# EAGLE design RAM (EAGLE 9.6.2)
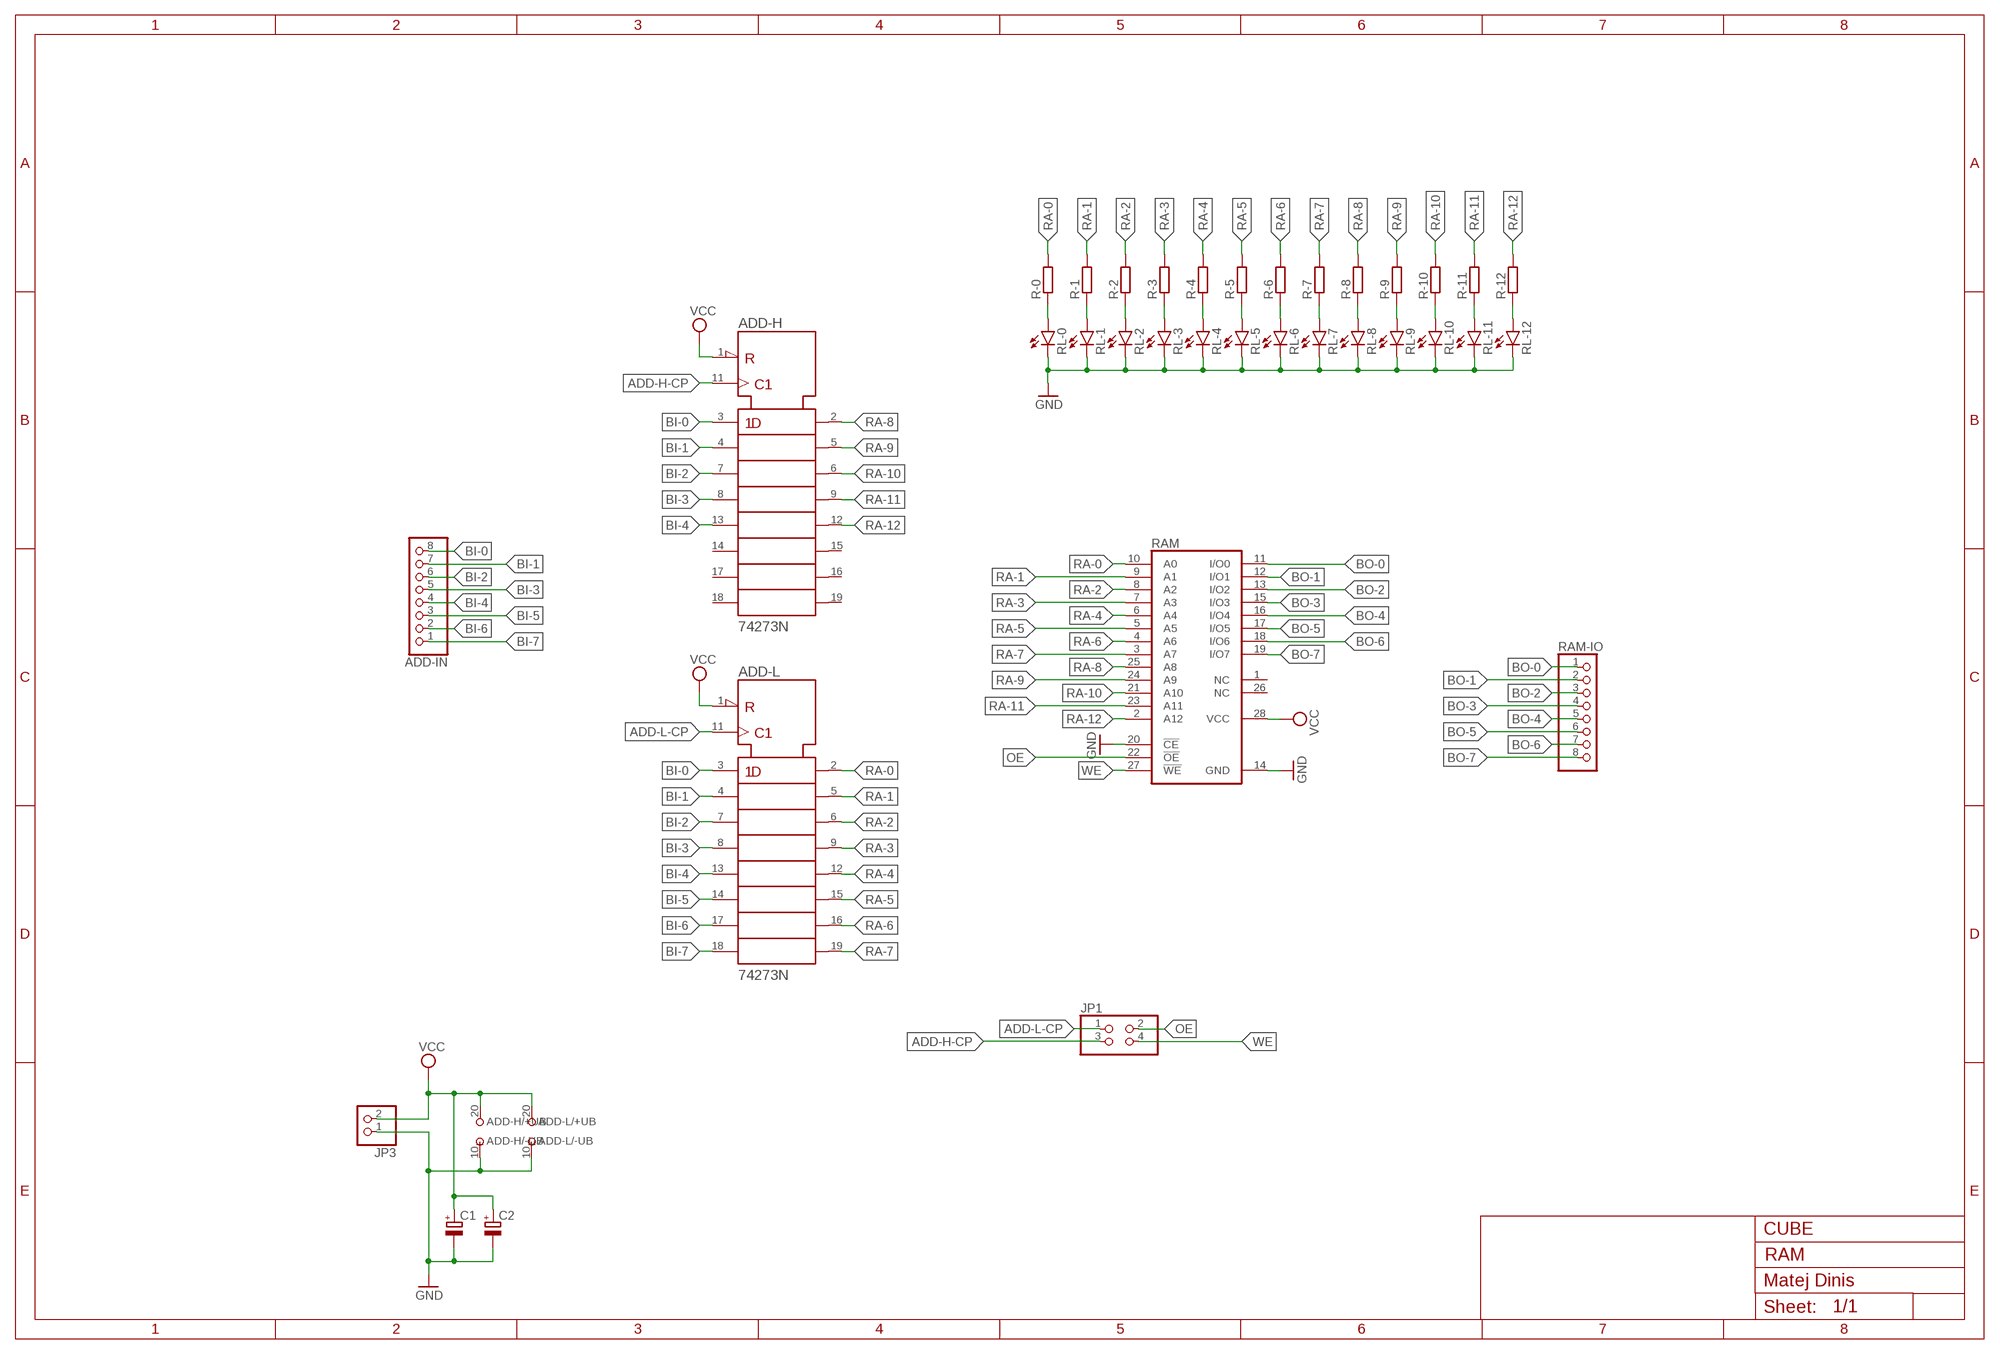
[diagram p0: schematic, sheet 1]

## Parts
ADD-H  74273N  [DIL20]
ADD-IN  PINHD-1X8  [1X08]
ADD-L  74273N  [DIL20]
C1  CPOL-EUE3.5-8  [E3,5-8]
C2  CPOL-EUE3.5-8  [E3,5-8]
JP1  PINHD-2X2  [2X02]
JP3  PINHD-1X2  [1X02]
R-0  R-EU_0207/10  [0207/10]
R-1  R-EU_0207/10  [0207/10]
R-2  R-EU_0207/10  [0207/10]
R-3  R-EU_0207/10  [0207/10]
R-4  R-EU_0207/10  [0207/10]
R-5  R-EU_0207/10  [0207/10]
R-6  R-EU_0207/10  [0207/10]
R-7  R-EU_0207/10  [0207/10]
R-8  R-EU_0207/10  [0207/10]
R-9  R-EU_0207/10  [0207/10]
R-10  R-EU_0207/10  [0207/10]
R-11  R-EU_0207/10  [0207/10]
R-12  R-EU_0207/10  [0207/10]
RAM  28C64C  [DIL28-6]
RAM-IO  PINHD-1X8  [1X08]
RL-0  LED5MM  [LED5MM]
RL-1  LED5MM  [LED5MM]
RL-2  LED5MM  [LED5MM]
RL-3  LED5MM  [LED5MM]
RL-4  LED5MM  [LED5MM]
RL-5  LED5MM  [LED5MM]
RL-6  LED5MM  [LED5MM]
RL-7  LED5MM  [LED5MM]
RL-8  LED5MM  [LED5MM]
RL-9  LED5MM  [LED5MM]
RL-10  LED5MM  [LED5MM]
RL-11  LED5MM  [LED5MM]
RL-12  LED5MM  [LED5MM]

## Nets
ADD-H-CP: ADD-H.11(CLK) JP1.3
ADD-L-CP: ADD-L.11(CLK) JP1.1
BI-0: ADD-H.3(1D) ADD-IN.8 ADD-L.3(1D)
BI-1: ADD-H.4(2D) ADD-IN.7 ADD-L.4(2D)
BI-2: ADD-H.7(3D) ADD-IN.6 ADD-L.7(3D)
BI-3: ADD-H.8(4D) ADD-IN.5 ADD-L.8(4D)
BI-4: ADD-H.13(5D) ADD-IN.4 ADD-L.13(5D)
BI-5: ADD-IN.3 ADD-L.14(6D)
BI-6: ADD-IN.2 ADD-L.17(7D)
BI-7: ADD-IN.1 ADD-L.18(8D)
BO-0: RAM-IO.1 RAM.11(I/O0)
BO-1: RAM-IO.2 RAM.12(I/O1)
BO-2: RAM-IO.3 RAM.13(I/O2)
BO-3: RAM-IO.4 RAM.15(I/O3)
BO-4: RAM-IO.5 RAM.16(I/O4)
BO-5: RAM-IO.6 RAM.17(I/O5)
BO-6: RAM-IO.7 RAM.18(I/O6)
BO-7: RAM-IO.8 RAM.19(I/O7)
GND: ADD-H.10(-UB) ADD-L.10(-UB) C1.- C2.- JP3.1 RAM.14(GND) RAM.20(!CE) RL-0.K(C) RL-1.K(C) RL-2.K(C) RL-3.K(C) RL-4.K(C) RL-5.K(C) RL-6.K(C) RL-7.K(C) RL-8.K(C) RL-9.K(C) RL-10.K(C) RL-11.K(C) RL-12.K(C)
N$1: R-0.1 RL-0.A
N$4: R-1.1 RL-1.A
N$7: R-2.1 RL-2.A
N$10: R-3.1 RL-3.A
N$13: R-4.1 RL-4.A
N$16: R-5.1 RL-5.A
N$19: R-6.1 RL-6.A
N$22: R-7.1 RL-7.A
N$25: R-8.1 RL-8.A
N$28: R-9.1 RL-9.A
N$31: R-10.1 RL-10.A
N$34: R-11.1 RL-11.A
N$37: R-12.1 RL-12.A
OE: JP1.2 RAM.22(!OE)
RA-0: ADD-L.2(1Q) R-0.2 RAM.10(A0)
RA-1: ADD-L.5(2Q) R-1.2 RAM.9(A1)
RA-2: ADD-L.6(3Q) R-2.2 RAM.8(A2)
RA-3: ADD-L.9(4Q) R-3.2 RAM.7(A3)
RA-4: ADD-L.12(5Q) R-4.2 RAM.6(A4)
RA-5: ADD-L.15(6Q) R-5.2 RAM.5(A5)
RA-6: ADD-L.16(7Q) R-6.2 RAM.4(A6)
RA-7: ADD-L.19(8Q) R-7.2 RAM.3(A7)
RA-8: ADD-H.2(1Q) R-8.2 RAM.25(A8)
RA-9: ADD-H.5(2Q) R-9.2 RAM.24(A9)
RA-10: ADD-H.6(3Q) R-10.2 RAM.21(A10)
RA-11: ADD-H.9(4Q) R-11.2 RAM.23(A11)
RA-12: ADD-H.12(5Q) R-12.2 RAM.2(A12)
VCC: ADD-H.1(!CLR) ADD-H.20(+UB) ADD-L.1(!CLR) ADD-L.20(+UB) C1.+ C2.+ JP3.2 RAM.28(VCC)
WE: JP1.4 RAM.27(!WE)
Unconnected: ADD-H.14(6D) ADD-H.15(6Q) ADD-H.16(7Q) ADD-H.17(7D) ADD-H.18(8D) ADD-H.19(8Q) RAM.1(NC) RAM.26(NC)

## Notes on the sheet
- CUBE
- Matej Dinis

## Library data of the parts
ADD-H ADD-L = 74ttl-din:74*273: Octal D type FLIP FLOP, clear
ADD-IN RAM-IO = pinhead:PINHD-1X8: PIN HEADER
C1 C2 = rcl:CPOL-EU: POLARIZED CAPACITOR, European symbol; SPICEPREFIX: C
JP1 = pinhead:PINHD-2X2: PIN HEADER
JP3 = pinhead:PINHD-1X2: PIN HEADER
R-0 R-1-R-12 = rcl:R-EU_: RESISTOR, European symbol; SPICEPREFIX: R
RAM = memory-nec:28C64C: MEMORY; MPN: AT28C64B-15PU; OC_FARNELL: 1095784; OC_NEWARK: 96K6557
RL-0 RL-1-RL-12 = led:LED: LED OSRAM: - CHIPLED LG R971, LG N971, LY N971, LG Q971, LY Q971, LO R971, LY R971 LH N974, LH R974 LS Q976, LO Q976, LY Q976 LO Q996 - Hyper CHIPLED LW Q18S LB Q993, LB Q99A, LB R99A - SideLED LS A670, LO A670, LY A670, LG A670, LP A670 LB A673, LV A673, LT A673, LW A673 LH A674 LY A675 LS A676, LA A676, LO A676, LY A676, LW A676 LS A679, LY A679, LG A679 - Hyper Micro SIDELED® LS Y876, LA Y876, LO Y876, LY Y876 LT Y87S - SmartLED LW L88C, LW L88S LB L89C, LB L89S, LG L890 LS L89K, LO L89K, LY L89K LS L896, LA L896, LO L896, LY L896 - TOPLED LS T670, LO T670, LY T670, LG T670, LP T670 LSG T670, LSP T670, LSY T670, LOP T670, LYG T670 LG T671, LOG T671, LSG T671 LB T673, LV T673, LT T673, LW T673 LH T674 LS T676, LA T676, LO T676, LY T676, LB T676, LH T676, LSB T676, LW T676 LB T67C, LV T67C, LT T67C, LS T67K, LO T67K, LY T67K, LW E67C LS E67B, LA E67B, LO E67B, LY E67B, LB E67C, LV E67C, LT E67C LW T67C LS T679, LY T679, LG T679 LS T770, LO T770, LY T770, LG T770, LP T770 LB T773, LV T773, LT T773, LW T773 LH T774 LS E675, LA E675, LY E675, LS T675 LS T776, LA T776, LO T776, LY T776, LB T776 LHGB T686 LT T68C, LB T68C - Hyper Mini TOPLED® LB M676 - Mini TOPLED Santana® LG M470 LS M47K, LO M47K, LY M47K Source: http://www.osram.convergy.de LUXEON: - LUMILED® LXK2-PW12-R00, LXK2-PW12-S00, LXK2-PW14-U00, LXK2-PW14-V00 LXK2-PM12-R00, LXK2-PM12-S00, LXK2-PM14-U00 LXK2-PE12-Q00, LXK2-PE12-R00, LXK2-PE12-S00, LXK2-PE14-T00, LXK2-PE14-U00 LXK2-PB12-K00, LXK2-PB12-L00, LXK2-PB12-M00, LXK2-PB14-N00, LXK2-PB14-P00, LXK2-PB14-Q00 LXK2-PR12-L00, LXK2-PR12-M00, LXK2-PR14-Q00, LXK2-PR14-R00 LXK2-PD12-Q00, LXK2-PD12-R00, LXK2-PD12-S00 LXK2-PH12-R00, LXK2-PH12-S00 LXK2-PL12-P00, LXK2-PL12-Q00, LXK2-PL12-R00 Source: www.luxeon.com KINGBRIGHT: KA-3528ASYC Source: www.kingbright.com

## Board
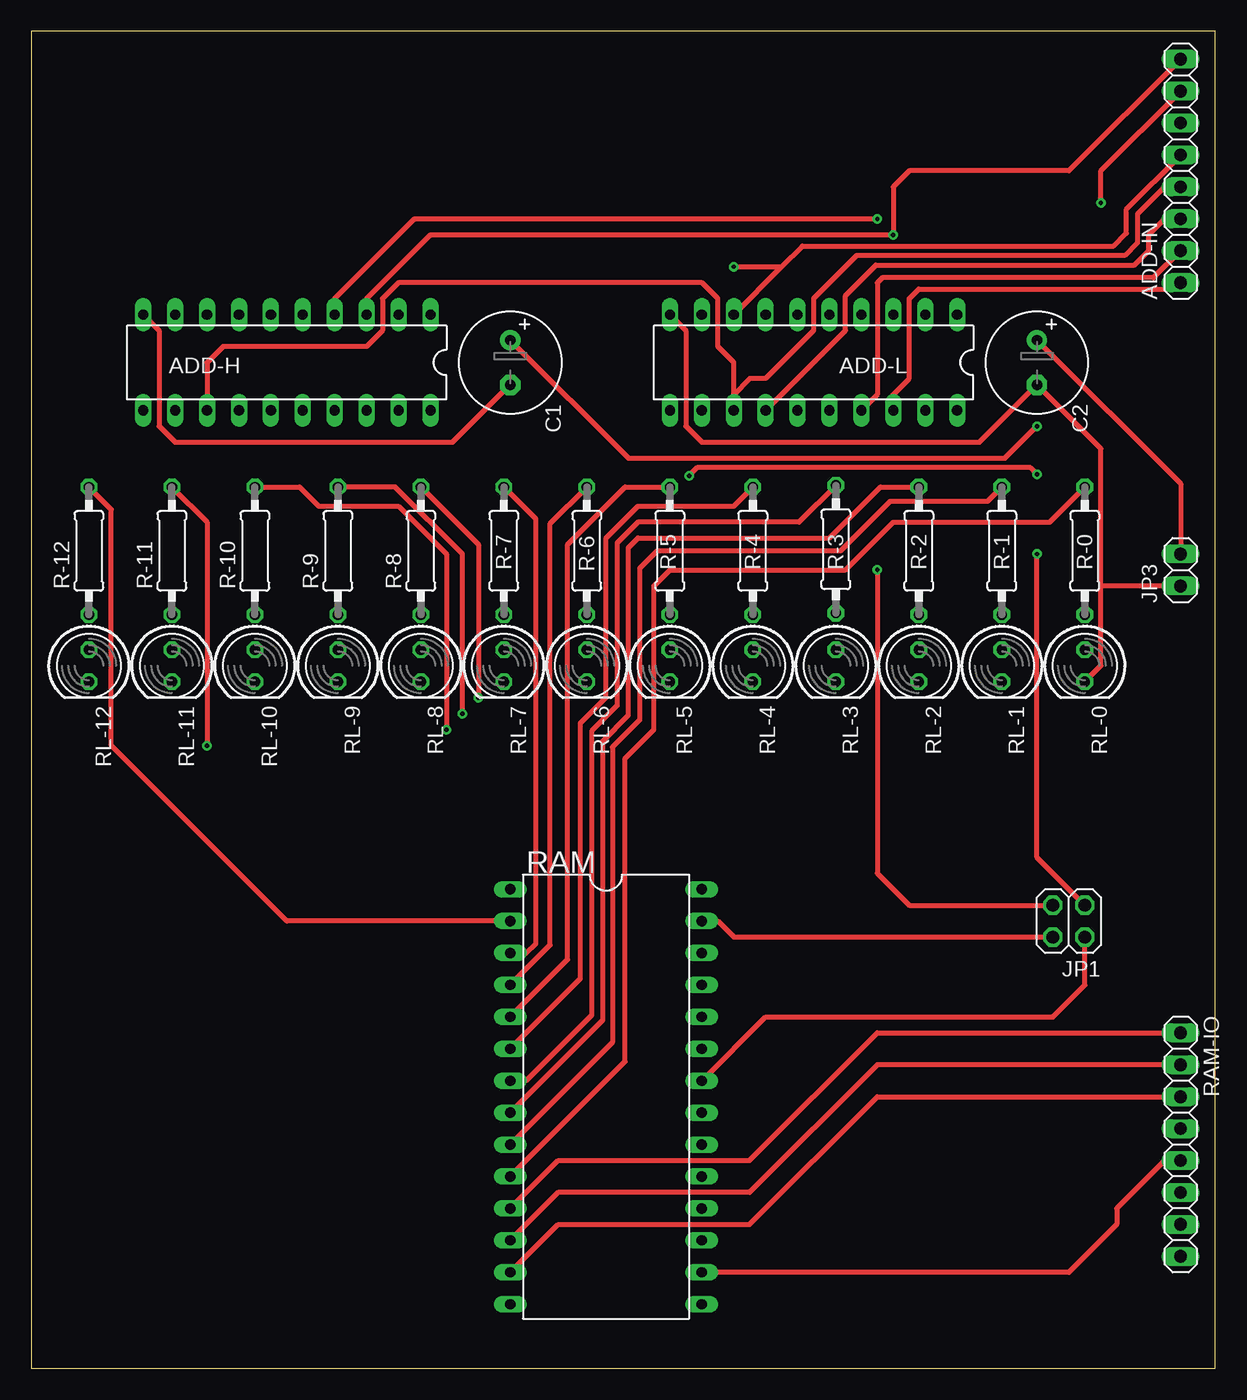
[diagram p1: board, top side]
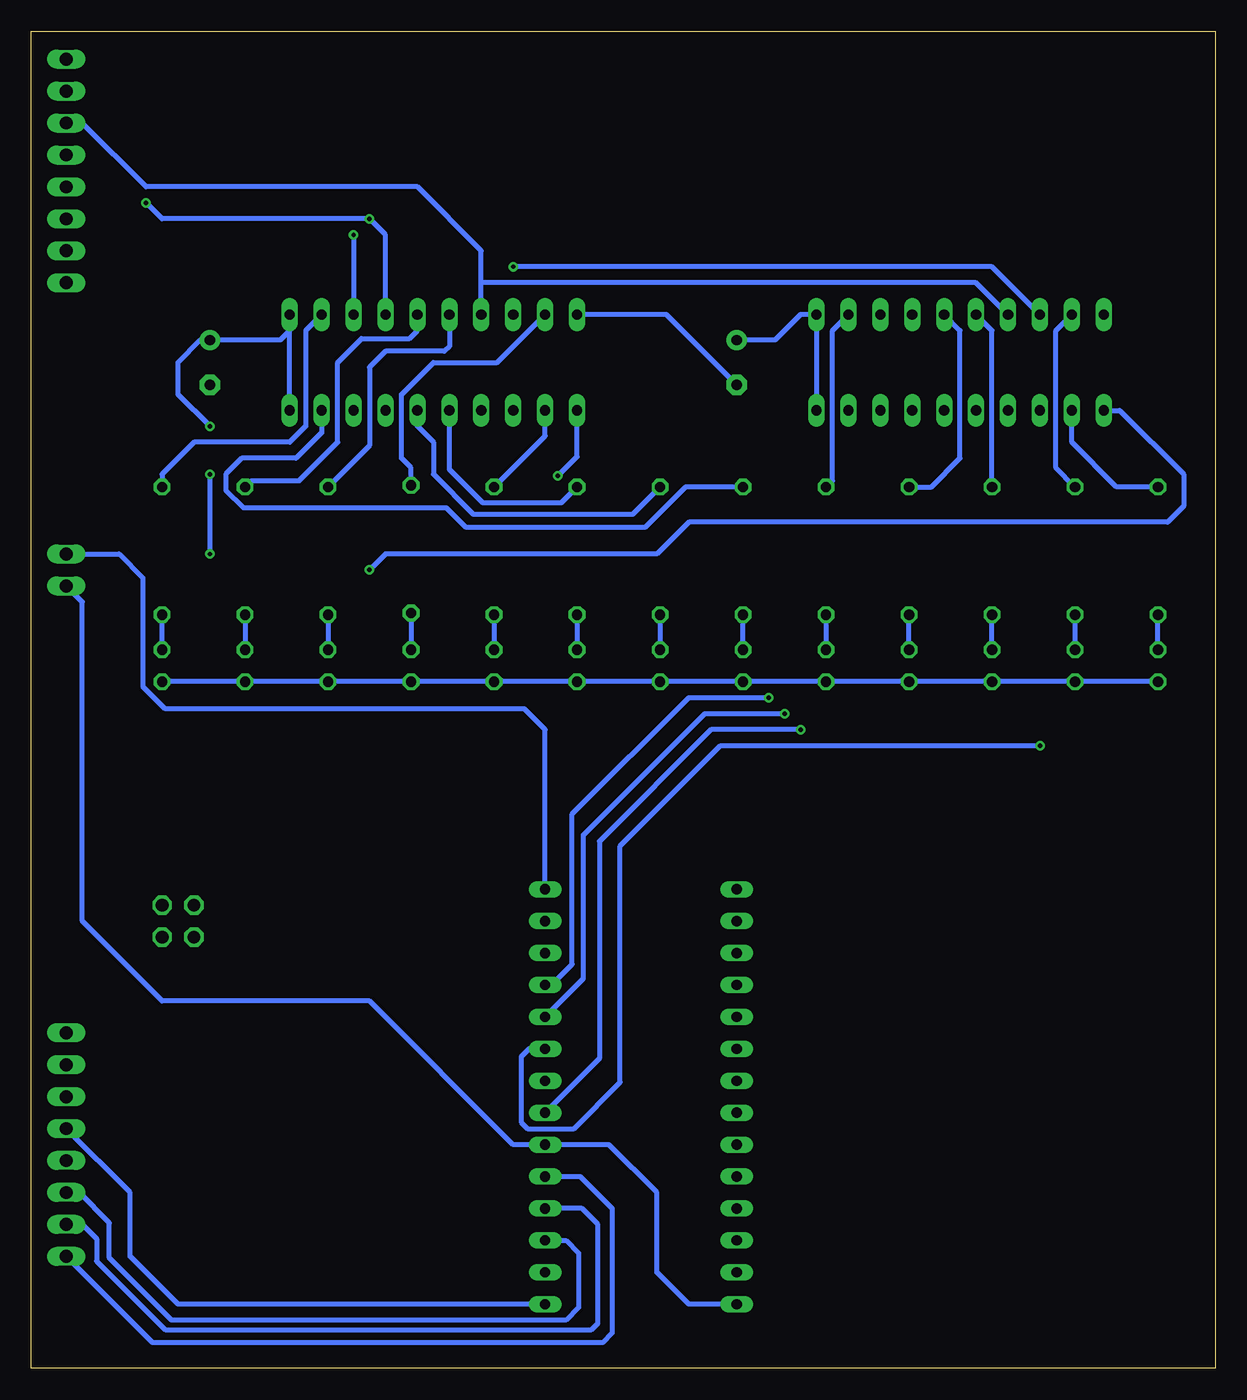
[diagram p2: board, bottom side, seen from below]

Size 94.21 x 106.35 mm. Coordinates in mm from the lower left corner, seen from the top.
Outline: 0,0 94.21,0 94.21,106.35 0,106.35 0,0
Copper layers (1*16): Top 0.035mm / dielectric 1.5mm / Bottom 0.035mm
Design rules "default": minimum track width 6mil, minimum drill 0.35mm, track to track 6mil, track to pad 6mil, pad to pad 6mil, via to via 6mil, smd to smd 6mil, copper to edge 40mil, drill to drill 6mil, minimum pad ring 10mil, minimum via ring 8mil, stop-mask expansion 4mil, vias tented up to drill 0mil, thermal gap 10mil

### Footprints (pad centres in the part's own frame; a part is rotated, then mirrored left to right if it is on the bottom)
DIL20 = drill 0.813 long: 1 -11.43,-3.81; 2 -8.89,-3.81; 3 -6.35,-3.81; 4 -3.81,-3.81; 5 -1.27,-3.81; 6 1.27,-3.81; 7 3.81,-3.81; 8 6.35,-3.81; 9 8.89,-3.81; 10 11.43,-3.81; 11 11.43,3.81; 12 8.89,3.81; 13 6.35,3.81; 14 3.81,3.81; 15 1.27,3.81; 16 -1.27,3.81; 17 -3.81,3.81; 18 -6.35,3.81; 19 -8.89,3.81; 20 -11.43,3.81
1X08 = drill 1.016 long: 1 -8.89,0; 2 -6.35,0; 3 -3.81,0; 4 -1.27,0; 5 1.27,0; 6 3.81,0; 7 6.35,0; 8 8.89,0
E3,5-8 = drill 0.813 pad 1.6: + -1.778,0 | drill 0.813 pad 1.6 octagon: - 1.778,0
2X02 = drill 1.016 octagon: 1 -1.27,-1.27; 2 -1.27,1.27; 3 1.27,-1.27; 4 1.27,1.27
1X02 = drill 1.016 long: 1 -1.27,0; 2 1.27,0
0207/10 = drill 0.813 octagon: 1 -5.08,0; 2 5.08,0
DIL28-6 = drill 0.813 long: 1 -16.51,-7.62; 2 -13.97,-7.62; 3 -11.43,-7.62; 4 -8.89,-7.62; 5 -6.35,-7.62; 6 -3.81,-7.62; 7 -1.27,-7.62; 8 1.27,-7.62; 9 3.81,-7.62; 10 6.35,-7.62; 11 8.89,-7.62; 12 11.43,-7.62; 13 13.97,-7.62; 14 16.51,-7.62; 15 16.51,7.62; 16 13.97,7.62; 17 11.43,7.62; 18 8.89,7.62; 19 6.35,7.62; 20 3.81,7.62; 21 1.27,7.62; 22 -1.27,7.62; 23 -3.81,7.62; 24 -6.35,7.62; 25 -8.89,7.62; 26 -11.43,7.62; 27 -13.97,7.62; 28 -16.51,7.62
LED5MM = drill 0.813 octagon: A -1.27,0; K 1.27,0

### Placement (x,y rotation side)
ADD-H  20.32,80.01 180 top
ADD-IN  91.44,95.25 90 top
ADD-L  62.23,80.01 180 top
C1  38.1,80.01 270 top
C2  80.01,80.01 270 top
JP1  82.55,35.56 180 top
JP3  91.44,63.5 90 top
R-0  83.82,65.02 90 top
R-1  77.22,65.02 90 top
R-2  70.61,65.02 90 top
R-3  64.01,65.15 90 top
R-4  57.4,65.02 90 top
R-5  50.8,65.02 90 top
R-6  44.2,65.02 90 top
R-7  37.59,65.02 90 top
R-8  30.99,65.02 90 top
R-9  24.38,65.02 90 top
R-10  17.78,65.02 90 top
R-11  11.18,65.02 90 top
R-12  4.57,65.02 90 top
RAM  45.72,21.59 270 top
RAM-IO  91.44,17.78 270 top
RL-0  83.82,55.88 270 top
RL-1  77.22,55.88 270 top
RL-2  70.61,55.88 270 top
RL-3  64.01,55.88 270 top
RL-4  57.4,55.88 270 top
RL-5  50.8,55.88 270 top
RL-6  44.2,55.88 270 top
RL-7  37.59,55.88 270 top
RL-8  30.99,55.88 270 top
RL-9  24.38,55.88 270 top
RL-10  17.78,55.88 270 top
RL-11  11.18,55.88 270 top
RL-12  4.57,55.88 270 top

### Tracks (layer width: path | path; a pad name or v marks a point on that pad's centre or on a via)
ADD-H-CP  (via drill 0.35)
  Top 0.4: v67.31,63.5 67.31,39.37 69.85,36.83 JP1.3
  Bottom 0.4: ADD-H.11 7.62,76.2 2.54,71.12 2.54,68.58 3.81,67.31 41.91,67.31 44.45,64.77 66.04,64.77 v67.31,63.5
ADD-L-CP  (via drill 0.35)
  Top 0.4: JP1.1 80.01,40.64 v80.01,64.77 | v80.01,71.12 79.5,71.63 52.96,71.63 v52.32,70.99
  Bottom 0.4: v80.01,64.77 v80.01,71.12 | v52.32,70.99 50.8,72.52 ADD-L.11
BI-0  (via drill 0.35)
  Top 0.4: ADD-IN.8 82.55,95.25 69.85,95.25 68.58,93.98 v68.58,90.17 31.75,90.17 26.67,85.09 ADD-H.3
  Bottom 0.4: v68.58,90.17 ADD-L.3
BI-1  (via drill 0.35)
  Top 0.4: v85.09,92.71 85.09,95.25 ADD-IN.7 | ADD-H.4 24.13,85.09 30.48,91.44 v67.31,91.44
  Bottom 0.4: ADD-L.4 66.04,90.17 v67.31,91.44 83.82,91.44 v85.09,92.71
BI-2
  Bottom 0.4: ADD-IN.6 90.17,99.06 85.09,93.98 63.5,93.98 58.42,88.9 58.42,86.36 | ADD-L.7 58.42,86.36 | ADD-H.7 19.05,86.36 58.42,86.36
BI-3  (via drill 0.35)
  Top 0.4: ADD-L.8 59.69,87.63 | 59.69,87.63 61.34,89.28 86.11,89.28 87.12,90.3 87.12,92.2 ADD-IN.5 | v55.88,87.63 59.69,87.63
  Bottom 0.4: ADD-H.8 17.78,87.63 v55.88,87.63
BI-4
  Top 0.4: ADD-IN.4 90.17,93.98 88.01,91.82 88.01,89.53 87,88.52 65.66,88.52 62.23,85.09 62.23,82.55 58.42,78.74 57.15,78.74 55.88,77.47 ADD-L.13 55.88,80.01 54.61,81.28 54.61,85.09 53.34,86.36 29.21,86.36 27.94,85.09 27.94,82.55 26.67,81.28 15.24,81.28 13.97,80.01 ADD-H.13
BI-5
  Top 0.4: ADD-L.14 64.77,82.55 64.77,85.34 67.18,87.76 87.76,87.76 88.9,88.9 88.9,90.17 90.17,91.44 ADD-IN.3
BI-6
  Top 0.4: 90.17,88.9 ADD-IN.2 89.28,86.74 67.69,86.74 67.31,86.36 67.31,77.47 ADD-L.17
BI-7
  Top 0.4: ADD-L.18 68.58,77.47 69.85,78.74 69.85,85.09 70.61,85.85 90.93,85.85 ADD-IN.1
BO-0
  Top 0.4: RAM.11 41.91,16.51 57.15,16.51 67.31,26.67 RAM-IO.1
BO-1
  Top 0.4: RAM.12 41.91,13.97 57.15,13.97 67.31,24.13 RAM-IO.2
BO-2
  Top 0.4: RAM.13 41.91,11.43 57.15,11.43 67.31,21.59 RAM-IO.3
BO-3
  Bottom 0.4: RAM-IO.4 86.36,13.97 86.36,8.89 82.55,5.08 RAM.15
BO-4
  Top 0.4: RAM-IO.5 90.17,16.51 86.36,12.7 86.36,11.43 82.55,7.62 RAM.16
BO-5
  Bottom 0.4: RAM-IO.6 90.42,13.97 88.01,11.56 88.01,8.76 83.06,3.81 51.69,3.81 50.67,4.83 50.67,9.14 51.69,10.16 RAM.17
BO-6
  Bottom 0.4: RAM-IO.7 90.17,11.43 89.03,10.29 89.03,8.51 83.57,3.05 49.66,3.05 49.15,3.56 49.15,11.43 50.42,12.7 RAM.18
BO-7
  Bottom 0.4: RAM-IO.8 84.58,2.03 48.77,2.03 48.01,2.79 48.01,12.7 50.55,15.24 RAM.19
GND
  Top 0.4: ADD-L.10 52.07,82.55 52.07,74.93 53.34,73.66 75.44,73.66 C2.- 85.09,73.15 85.09,62.23 | RL-0.K 85.09,55.88 85.09,62.23 | ADD-H.10 10.16,82.55 10.16,74.93 11.43,73.66 33.53,73.66 C1.- | JP3.1 85.09,62.23
  Bottom 0.4: RL-0.K RL-1.K RL-2.K RL-3.K RL-4.K RL-5.K RL-6.K RL-7.K RL-8.K RL-9.K RL-10.K RL-11.K RL-12.K | C1.- 43.69,83.82 ADD-L.10 | RAM.14 41.91,5.08 44.45,7.62 44.45,13.97 48.26,17.78 RAM.20 55.88,17.78 67.31,29.21 83.82,29.21 90.17,35.56 90.17,60.96 JP3.1
N$1
  Bottom 0.4: RL-0.A R-0.1
N$4
  Bottom 0.4: R-1.1 RL-1.A
N$7
  Bottom 0.4: R-2.1 RL-2.A
N$10
  Bottom 0.4: R-3.1 RL-3.A
N$13
  Bottom 0.4: R-4.1 RL-4.A
N$16
  Bottom 0.4: R-5.1 RL-5.A
N$19
  Bottom 0.4: R-6.1 RL-6.A
N$22
  Bottom 0.4: RL-7.A R-7.1
N$25
  Bottom 0.4: R-8.1 RL-8.A
N$28
  Bottom 0.4: RL-9.A R-9.1
N$31
  Bottom 0.4: RL-10.A R-10.1
N$34
  Bottom 0.4: R-11.1 RL-11.A
N$37
  Bottom 0.4: RL-12.A R-12.1
OE
  Top 0.4: RAM.22 58.42,27.94 81.28,27.94 83.82,30.48 JP1.2
RA-0
  Top 0.4: RAM.10 47.24,24.38 47.24,48.51 49.53,50.8 49.53,62.23 50.8,63.5 64.77,63.5 68.58,67.31 81.03,67.31 R-0.2
  Bottom 0.4: ADD-L.2 72.39,82.55 72.39,74.93 73.66,73.66 81.28,73.66 83.82,71.12 R-0.2
RA-1
  Top 0.4: R-1.2 76.07,68.96 68.33,68.96 64.39,65.02 49.78,65.02 48.39,63.63 48.39,51.56 46.23,49.4 46.23,25.91 RAM.9
  Bottom 0.4: R-1.2 76.71,70.61 72.9,70.61 69.85,73.66 69.85,80.01 67.94,81.92 64.14,81.92 63.5,82.55 ADD-L.5
RA-2
  Top 0.4: RAM.8 45.47,27.69 45.47,49.91 47.5,51.94 47.5,65.28 48.26,66.04 63.5,66.04 67.56,70.1 R-2.2
  Bottom 0.4: ADD-L.6 60.96,81.28 61.34,80.9 66.04,80.9 67.31,79.63 67.31,73.41 R-2.2
RA-3
  Top 0.4: R-3.2 61.09,67.31 48.26,67.31 46.61,65.66 46.61,52.7 44.58,50.67 44.58,28.07 39.37,22.86 RAM.7
  Bottom 0.4: R-3.2 64.01,71.63 64.77,72.39 64.77,77.47 62.23,80.01 57.15,80.01 ADD-L.9
RA-4
  Top 0.4: RAM.6 43.69,30.99 43.69,51.31 45.72,53.34 45.72,66.04 48.26,68.58 55.88,68.58 R-4.2
  Bottom 0.4: R-4.2 53.34,74.17 ADD-L.12
RA-5
  Top 0.4: RAM.5 42.67,32.51 42.67,65.53 47.24,70.1 R-5.2
  Bottom 0.4: R-5.2 52.07,68.83 58.29,68.83 60.96,71.5 ADD-L.15
RA-6
  Top 0.4: RAM.4 41.27,33.66 41.27,67.18 R-6.2
  Bottom 0.4: ADD-L.16 63.5,74.93 62.23,73.66 62.23,71.12 59.05,67.94 46.35,67.94 R-6.2
RA-7
  Top 0.4: RAM.3 39.37,33.02 40.13,33.78 40.13,67.56 R-7.2
  Bottom 0.4: R-7.2 42.16,70.1 45.34,66.93 59.69,66.93 61.21,68.45 77.34,68.45 78.74,69.85 78.74,71.12 77.47,72.39 73.15,72.39 71.12,74.42 ADD-L.19
RA-8  (via drill 0.35)
  Top 0.4: R-8.2 35.56,65.53 v35.56,53.34
  Bottom 0.4: R-8.2 30.48,70.61 30.48,82.55 ADD-H.2 | v35.56,53.34 41.91,53.34 51.18,44.07 51.18,32.13 52.83,30.48 RAM.25
RA-9  (via drill 0.35)
  Top 0.4: v34.29,52.07 34.29,64.77 28.96,70.1 R-9.2
  Bottom 0.4: R-9.2 22.61,70.1 20.32,72.39 20.32,82.55 ADD-H.5 | RAM.24 50.29,30.99 50.29,42.42 40.64,52.07 v34.29,52.07
RA-10  (via drill 0.35)
  Top 0.4: R-10.2 21.34,70.1 22.86,68.58 29.21,68.58 33.02,64.77 v33.02,50.8
  Bottom 0.4: ADD-H.6 17.78,82.55 R-10.2 | v33.02,50.8 40.13,50.8 49.02,41.91 49.02,24.64 RAM.21
RA-11  (via drill 0.35)
  Top 0.4: v13.97,49.53 13.97,67.31 R-11.2
  Bottom 0.4: R-11.2 12.7,71.63 12.7,82.55 ADD-H.9 | RAM.23 54.61,25.4 55.24,24.77 55.24,19.56 54.74,19.05 51.05,19.05 47.37,22.73 47.37,41.53 39.37,49.53 v13.97,49.53
RA-12
  Top 0.4: RAM.2 20.32,35.56 6.35,49.53 6.35,68.33 R-12.2
  Bottom 0.4: R-12.2 7.87,70.1 11.43,73.66 ADD-H.12
VCC  (via drill 0.35)
  Top 0.4: C1.+ 47.5,72.39 77.47,72.39 v80.01,74.93 | C2.+ 91.44,70.36 JP3.2
  Bottom 0.4: ADD-L.20 73.66,82.55 | 73.66,82.55 ADD-L.1 | 73.66,82.55 74.42,81.79 C2.+ 80.77,81.79 82.55,80.01 82.55,77.47 v80.01,74.93 | ADD-H.20 ADD-H.1 33.02,83.82 35.05,81.79 C1.+ | JP3.2 87.25,64.77 85.34,62.87 85.34,54.23 83.57,52.45 54.99,52.45 53.34,50.8 RAM.28
WE
  Top 0.4: RAM.27 54.61,35.56 55.88,34.29 JP1.4